# Altium schematic sheet STM32_2_Sheet2.SchDoc
size A4
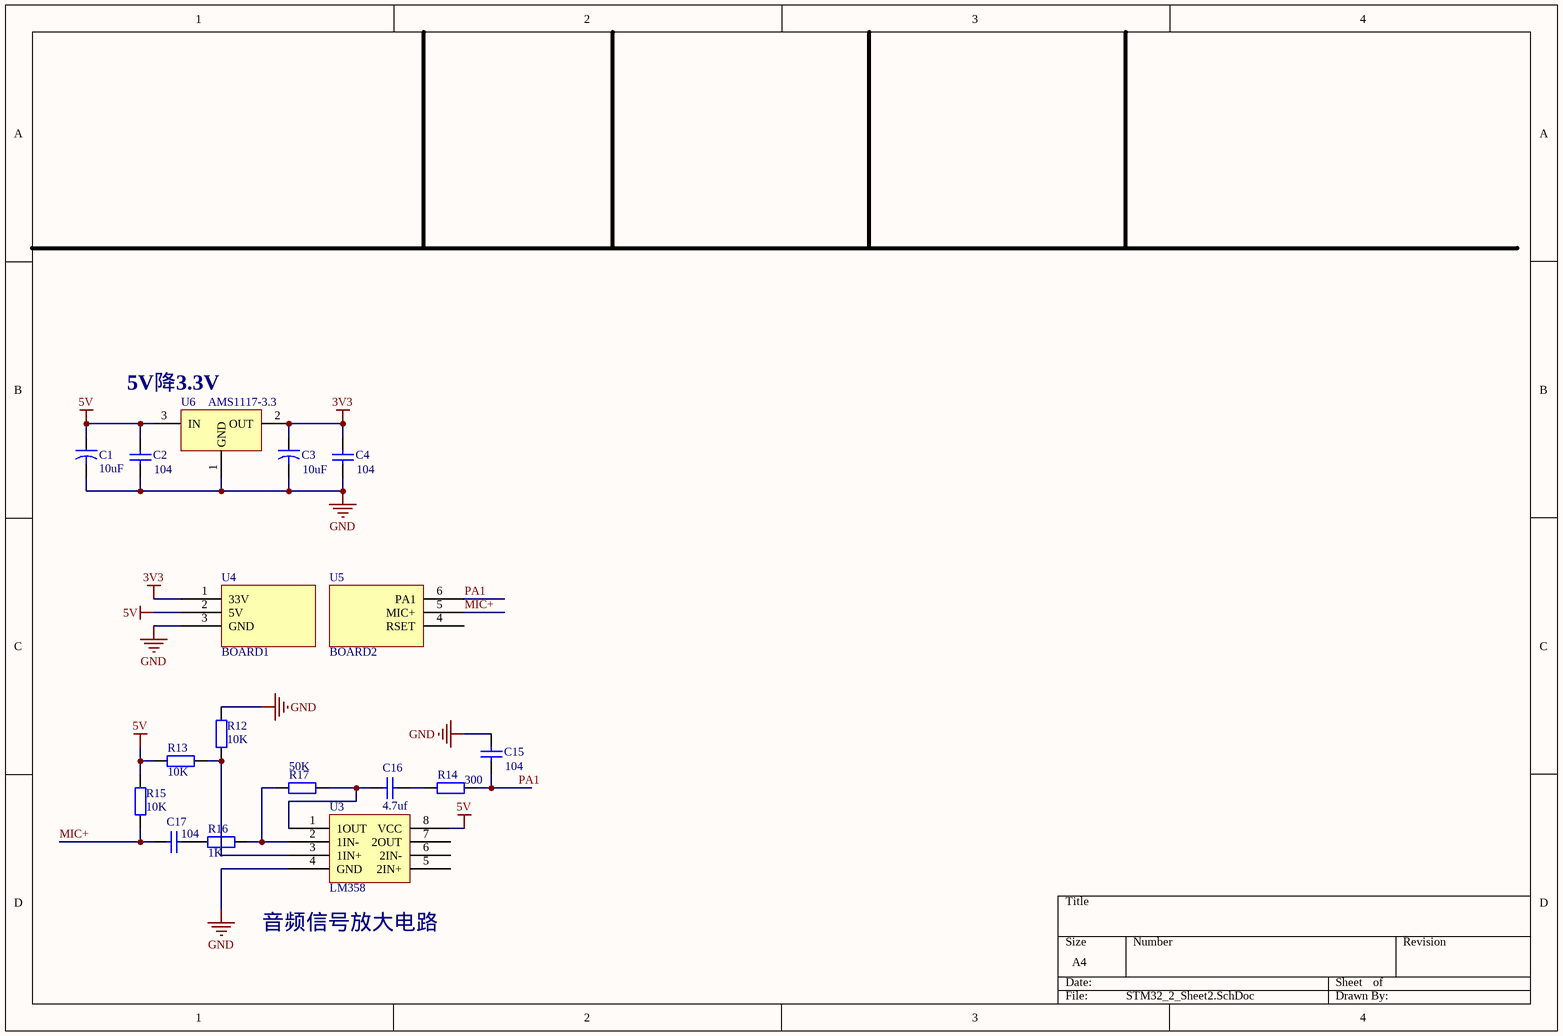
[diagram p0: STM32_2_Sheet2.SchDoc]

## Parts
C1  10uF  [RC0805]
C2  104  [RC0603]
C3  10uF  [RC0805]
C4  104  [RC0603]
C15  104  [RC0603]
C16  4.7uf  [RC0805]
C17  104  [RC0603]
R12  10K  [RC0603]
R13  10K  [RC0603]
R14  300  [RC0805]
R15  10K  [RC0603]
R16  1K  [RC0805]
R17  50K  [RC0603]
U3  LM358  [SOP8_M]
U4  BOARD1  [board1]
U5  BOARD2  [board2]
U6  AMS1117-3.3  [SOT89_M]

## Nets
3V3: C3.1 C4.2 U4.1(33V) U6.2(OUT)
5V: C1.1 C2.2 R13.2 R15.1 U3.8(VCC) U4.2(5V) U6.3(IN)
GND: C1.2 C2.1 C3.2 C4.1 C15.2 R12.2 U3.4(GND) U4.3(GND) U6.1(GND)
MIC+: C17.2 R15.2 U5.5(MIC+)
PA1: C15.1 R14.2 U5.6(PA1)
NetC16_1: C16.1 R14.1
NetC16_2: C16.2 R17.1 U3.1(1OUT)
NetC17_1: C17.1 R16.1
NetR12_1: R12.1 R13.1 U3.3(1IN+)
NetR16_2: R16.2 R17.2 U3.2(1IN-)

Not connected (* = marked no-connect by the designer): U3 5(2IN+) 6(2IN-) 7(2OUT); U5 4(RSET)

## Notes on the sheet
- (near U6) 5V降3.3V
- (near U3) 音频信号放大电路

## Library data of the parts
C1 C3 = Cap2: Capacitor; Published: 23-Sep-2002; PackageReference: CAPR5-4X5; Publisher: Altium Limited; PackageDescription: Capacitor; 2 Leads
  C3: Value: 10uF
C2 C4 C15-C17 = Cap: Capacitor; Published: 8-Jun-2000; LatestRevisionDate: 17-Jul-2002; LatestRevisionNote: Re-released for DXP Platform.; PackageReference: RAD-0.3; Publisher: Altium Limited; PackageDescription: Radial Cap, Thru-Hole; 2 Leads; 0.3 in Pin Spacing
  C2 C4 C15 C17: Value: 104
  C16: Value: 4.7uf
R12-R17 = Res2: Resistor; Published: 8-Jun-2000; LatestRevisionDate: 17-Jul-2002; LatestRevisionNote: Re-released for DXP Platform.; PackageReference: AXIAL-0.4; Publisher: Altium Limited; PackageDescription: Axial Device, Thru-Hole; 2 Leads; 0.4 in Pin Spacing
  R12 R13 R15: Value: 10K
  R14: Value: 300
  R16: Value: 1K
  R17: Value: 50K
U3 = LM358: 音频放大
U6 = AMS1117-3.3: 5V稳3.3V